# Altium schematic sheet ADC_PowerSupply.SchDoc
size A4; Organization: Altium Limited; Address1: L3, 12a Rodborough Rd; Address2: Frenchs Forest; Address3: NSW; Address4: Australia 2086
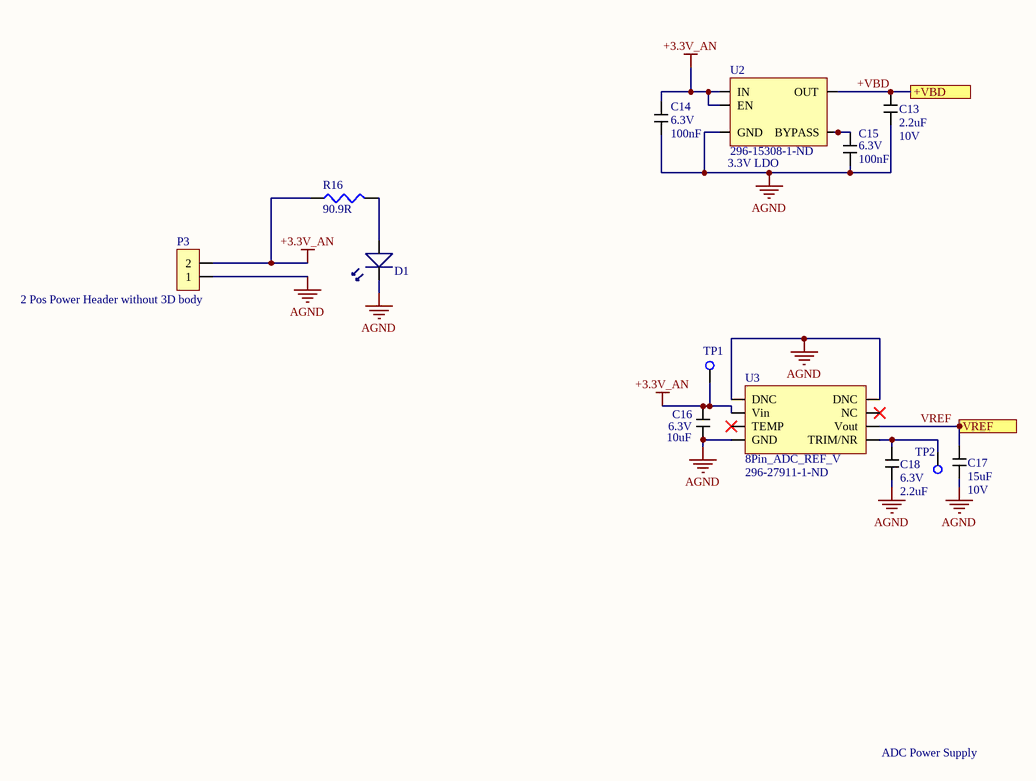
[diagram p0: ADC_PowerSupply.SchDoc]

## Parts
C13  Capacitance: 2.2uF  Voltage Rating: 10V  [2.2uF LDO Output Bypass Cap]  (hidden comment: 2.2uF LDO Bypass Cap)
C14  Voltage Rating: 6.3V  Capacitance: 100nF  [0.1uF Bypass Capacitor]  (hidden comment: 0.1uF)
C15  Voltage Rating: 6.3V  Capacitance: 100nF  [0.1uF Bypass Capacitor]  (hidden comment: 0.1uF)
C16  Voltage Rating: 6.3V  Capacitance: 10uF  [0805_MD_CAP]  (hidden comment: ADC_Volt_Ref_Input_Bypass_CAP10uF)
C17  Capacitance: 15uF  Voltage Rating: 10V  [1206_MD_CAP_Width_MOD]  (hidden comment: ADC_REF_VOLT_OUTPUT_CAP15UF)
C18  Voltage Rating: 6.3V  Capacitance: 2.2uF  [0603_MD_CAP]  (hidden comment: ADC_REF_VOLT_TRIM_CAP2.2UF)
D1  LED  [Green_SMD_LED]  (value not drawn)
P3  2 Pos Power Header without 3D body  [2 Pos Power Header - duplicate]
R16  Resistance: 90.9R  [Green_LED_Resistor_90.9]  (hidden comment: Green)
TP1  Test Point  [Test Point]  (value not drawn)
TP2  Test Point  [Test Point]  (value not drawn)
U2  Supplier Part Number 1: 296-15308-1-ND  [3.3V Dig ADC Supply]  (hidden comment: 3.3V Digital ADC Supply)
U3  8Pin_ADC_REF_V  Supplier Part Number 1: 296-27911-1-ND  [SOIC127P600X175-8N]

## Ports
+VBD, VREF

## Nets
+3.3V_AN: C14.2 C16.2 P3.2 R16.1 TP1.1 U2.1(IN) U2.3(EN) U3.2(Vin)
AGND: C13.1 C14.1 C15.1 C16.1 C17.1 C18.1 D1.1 P3.1 U2.2(GND) U3.1(DNC) U3.4(GND) U3.8(DNC)
+VBD: C13.2 U2.5(OUT) ; port +VBD
VREF: C17.2 U3.6(Vout) ; port VREF
NetC15_2: C15.2 U2.4(BYPASS)
NetC18_2: C18.2 TP2.1 U3.5(TRIM/NR)
NetD1_2: D1.2 R16.2

Not connected (* = marked no-connect by the designer): U3 3(TEMP)* 7(NC)*

## Notes on the sheet
- (near U2) 3.3V LDO
- ADC Power Supply
- Title
- Size:
- Date:
- A4
- Number:
- Time:
- Revision:
- Sheet
- of
- File:

## Library data of the parts
C13 = 2.2uF LDO Bypass Cap: 2.2µF ±10% 10V Ceramic Capacitor X7R 0805 (2012 Metric); Manufacturer: KEMET; Manufacturer Part Number: C0805C225K8RACAUTO; Supplier 1: Digi-Key; Stock 1: 53616; Pricing 1: 1=0.25000, 10=0.17200, 100=0.09770, 500=0.06898, 1000=0.06035 (USD); RoHS: Yes; Mount: Surface Mount; Case/Package: 0805; Case Code (Metric): 2012; Case Code (Imperial): 0805; Dielectric Material: Ceramic; Min Operating Temperature: -55°C; Max Operating Temperature: 125°C; Tolerance: 10%; Package Quantity: 1; Packaging: Cut Tape; Dielectric: X7R; Voltage Rating (DC): 10V; Length: 2mm; Height: 1.25mm; Width: 0.049inch; Thickness: 0.055inch; Depth: 1.25mm; Ratings: AEC-Q200; Radiation Hardening: No; REACH SVHC: No SVHC; ComponentLink1URL: http://www.farnell.com/datasheets/2741162.pdf?src-supplier=Farnell; ComponentLink1Description: http://www.farnell.com/datasheets/2741162.pdf?src-supplier=Farnell; ComponentLink2URL: http://components.arrow.com/part/dataview/0323_00327875?src-supplier=Arrow+Europe; ComponentLink2Description: http://components.arrow.com/part/dataview/0323_00327875?src-supplier=Arrow+Europe; ComponentLink3URL: http://components.arrow.com/part/dataview/43510464S9781270N7429?src-supplier=Arrow; ComponentLink3Description: http://components.arrow.com/part/dataview/43510464S9781270N7429?src-supplier=Arrow; ComponentLink4URL: http://www.farnell.com/datasheets/2741162.pdf?src-supplier=Newark; ComponentLink4Description: http://www.farnell.com/datasheets/2741162.pdf?src-supplier=Newark; ComponentLink5URL: http://www.farnell.com/datasheets/2120827.pdf?src-supplier=Element14; ComponentLink5Description: http://www.farnell.com/datasheets/2120827.pdf?src-supplier=Element14; ComponentLink6URL: http://capacitoredge.kemet.com/capedge2/DataSheet?pn=C0805C225K8RACAUTO&src-supplier=Avnet+Europe; ComponentLink6Description: http://capacitoredge.kemet.com/capedge2/DataSheet?pn=C0805C225K8RACAUTO&src-supplier=Avnet+Europe; ComponentLink7URL: https://search.kemet.com/component-edge/download/specsheet/C0805C225K8RACAUTO.pdf?src-supplier=Digi-Key; ComponentLink7Description: https://search.kemet.com/component-edge/download/specsheet/C0805C225K8RACAUTO.pdf?src-supplier=Digi-Key; ComponentLink8URL: https://api.kemet.com/component-edge/download/datasheet/C0805C225K8RACAUTO.pdf?src-supplier=Digi-Key; ComponentLink8Description: https://api.kemet.com/component-edge/download/datasheet/C0805C225K8RACAUTO.pdf?src-supplier=Digi-Key; Supplier Part Number 1: 399-6951-1-ND
C14 C15 = 0.1uF Cap: 0.1uF Bypass Cap; Manufacturer: KEMET; Manufacturer Part Number: C0603C104K9RACTU; Dielectric Material: Ceramic; Tolerance: 10%; Dielectric: X7R; Dissipation Factor: 5%; RoHS: Yes; Mount: Surface Mount; Case/Package: 0603; Case Code (Imperial): 0603; Case Code (Metric): 1608; Min Operating Temperature: -55°C; Max Operating Temperature: 125°C; Package Quantity: 4000; Packaging: Tape and Reel; Voltage Rating (DC): 6.3V; Termination: SMD/SMT; Length: 1.6mm; Height: 0.8mm; Width: 0.8mm; Thickness: 0.034inch; ComponentLink1URL: https://datasheet.ciiva.com/13371/kem-c1002-x7r-smd-357932-13371879.pdf?src-supplier=Mouser; ComponentLink1Description: https://datasheet.ciiva.com/13371/kem-c1002-x7r-smd-357932-13371879.pdf?src-supplier=Mouser; Supplier 1: Digi-Key; Stock 1: 758; Pricing 1: 1=0.19000, 10=0.13800, 100=0.06480, 500=0.04546, 1000=0.03763 (USD); Supplier Part Number 1: 399-15351-1-ND
C16 = ADC_Volt_Ref_Input_Bypass_CAP10uF: 10µF ±10% 6.3V Ceramic Capacitor X7R 0805 (2012 Metric); Manufacturer: Taiyo Yuden; Manufacturer Part Number: JMK212AB7106KGHT; Supplier 1: Digi-Key; RoHS: Yes; Stock 1: 179784; Pricing 1: 1 = 0.29000, 10 = 0.19900, 100 = 0.11250, 500 = 0.07940, 1000 = 0.06948 (USD); Mount: Surface Mount; Case/Package: 0805; Case Code (Metric): 2012; Case Code (Imperial): 0805; Min Operating Temperature: -55°C; Max Operating Temperature: 125°C; Package Quantity: 3000; Packaging: Tape and Reel; Tolerance: 10%; Voltage Rating (DC): 6.3V; Dielectric: X7R; Termination: SMD/SMT; Length: 0.079inch; Height: 1.25mm; Width: 0.049inch; Thickness: 0.053inch; Ratings: AEC-Q200; Lead Free: Lead Free; Halogen Free: Halogen Free; ComponentLink1URL: https://datasheet.ciiva.com/18697/mlcc01-hq-e-18697416.pdf?src-supplier=Digi-Key; ComponentLink1Description: https://datasheet.ciiva.com/18697/mlcc01-hq-e-18697416.pdf?src-supplier=Digi-Key; ComponentLink2URL: https://datasheet.ciiva.com/18697/mlcc01-hq-e-18697417.pdf?src-supplier=Digi-Key; ComponentLink2Description: https://datasheet.ciiva.com/18697/mlcc01-hq-e-18697417.pdf?src-supplier=Digi-Key; ComponentLink3URL: https://datasheet.ciiva.com/18697/mlcc01-hq-e-18697418.pdf?src-supplier=Digi-Key; ComponentLink3Description: https://datasheet.ciiva.com/18697/mlcc01-hq-e-18697418.pdf?src-supplier=Digi-Key; Supplier Part Number 1: 587-3388-1-ND
C17 = ADC_REF_VOLT_OUTPUT_CAP15UF: 15µF Molded Tantalum Capacitors 10V 1206 (3216 Metric) 1Ohm; Manufacturer: Kyocera AVX; Manufacturer Part Number: TPSA156K010R1000; Tolerance: 10%; ESR (Equivalent Series Resistance): 1R; Ripple Current: 110uA; Leakage Current: 1.5uA; Dissipation Factor: 6%; Polarity: Polar; Supplier 1: Digi-Key; RoHS: Yes; Stock 1: 4016; Pricing 1: 1 = 0.48000, 10 = 0.33300, 100 = 0.19980, 500 = 0.14986, 1000 = 0.12654 (USD); Mount: Surface Mount,PCB; Case/Package: 1206; Number of Pins: 2; Weight: 0.000571oz; Case Code (Metric): 3216; Case Code (Imperial): 1206; Dielectric Material: Tantalum; Min Operating Temperature: -55°C; Max Operating Temperature: 125°C; Packaging: Tape and Reel; Voltage Rating (DC): 10V; Package Quantity: 1; Termination: SMD/SMT; Voltage: 10V; Features: General Purpose; Length: 3.2mm; Height: 1.6mm; Width: 1.6mm; Height - Seated (Max): 0.071inch; Depth: 1.6mm; Radiation Hardening: No; REACH SVHC: No SVHC; Lead Free: Lead Free; ComponentLink1URL: https://datasheet.ciiva.com/11793/0900766b80962b61-11793618.pdf?src-supplier=RSComponents; ComponentLink1Description: https://datasheet.ciiva.com/11793/0900766b80962b61-11793618.pdf?src-supplier=RSComponents; ComponentLink2URL: https://datasheet.ciiva.com/19467/2019434-19467308.pdf?src-supplier=Jameco; ComponentLink2Description: https://datasheet.ciiva.com/19467/2019434-19467308.pdf?src-supplier=Jameco; ComponentLink3URL: https://datasheet.ciiva.com/263/tps-263720.pdf?src-supplier=Digi-Key; ComponentLink3Description: https://datasheet.ciiva.com/263/tps-263720.pdf?src-supplier=Digi-Key; ComponentLink4URL: https://datasheet.ciiva.com/263/tps-263721.pdf?src-supplier=Digi-Key; ComponentLink4Description: https://datasheet.ciiva.com/263/tps-263721.pdf?src-supplier=Digi-Key; ComponentLink5URL: https://datasheet.ciiva.com/7914/1680477-7914730.pdf?src-supplier=Element14; ComponentLink5Description: https://datasheet.ciiva.com/7914/1680477-7914730.pdf?src-supplier=Element14; ComponentLink6URL: https://datasheet.ciiva.com/263/tps-263722.pdf?src-supplier=Digi-Key; ComponentLink6Description: https://datasheet.ciiva.com/263/tps-263722.pdf?src-supplier=Digi-Key; ComponentLink7URL: https://datasheet.ciiva.com/3004/tps-3004586.pdf?src-supplier=Avnet; ComponentLink7Description: https://datasheet.ciiva.com/3004/tps-3004586.pdf?src-supplier=Avnet; ComponentLink8URL: https://datasheet.ciiva.com/12911/tps-23028-12911578.pdf?src-supplier=Mouser; ComponentLink8Description: https://datasheet.ciiva.com/12911/tps-23028-12911578.pdf?src-supplier=Mouser; ComponentLink9URL: https://datasheet.ciiva.com/14596/70001047-14596906.pdf?src-supplier=Allied+Electronics; ComponentLink9Description: https://datasheet.ciiva.com/14596/70001047-14596906.pdf?src-supplier=Allied+Electronics; ComponentLink10URL: https://datasheet.ciiva.com/7914/1680477-7914731.pdf?src-supplier=Element14; ComponentLink10Description: https://datasheet.ciiva.com/7914/1680477-7914731.pdf?src-supplier=Element14; ComponentLink11URL: https://datasheet.ciiva.com/7914/1680477-7914732.pdf?src-supplier=Element14; ComponentLink11Description: https://datasheet.ciiva.com/7914/1680477-7914732.pdf?src-supplier=Element14; Supplier Part Number 1: 478-1752-1-ND
C18 = ADC_REF_VOLT_TRIM_CAP2.2UF: 2.2µF ±10% 6.3V Ceramic Capacitor X7R 0603 (1608 Metric); Manufacturer: Taiyo Yuden; Manufacturer Part Number: JMK107B7225KAHTR; Supplier 1: Digi-Key; RoHS: No; Stock 1: 55560; Pricing 1: 1 = 0.24000, 10 = 0.16600, 100 = 0.09400, 500 = 0.06638, 1000 = 0.05808 (USD); Mount: Surface Mount; Case/Package: 0603; Case Code (Imperial): 0603; Case Code (Metric): 1608; Min Operating Temperature: -55°C; Max Operating Temperature: 125°C; Packaging: Cut Tape; Tolerance: 10%; Ratings: AEC-Q200; ComponentLink1URL: http://ds.yuden.co.jp/TYCOMPAS/ut/detail.do?productNo=JMK107B7225KAHTR&fileName=JMK107B7225KAHTR_SS&mode=specSheetDownload&src-supplier=Digi-Key; ComponentLink1Description: http://ds.yuden.co.jp/TYCOMPAS/ut/detail.do?productNo=JMK107B7225KAHTR&fileName=JMK107B7225KAHTR_SS&mode=specSheetDownload&src-supplier=Digi-Key; ComponentLink2URL: https://www.yuden.co.jp/productdata/catalog//mlcc11_hq_e.pdf?src-supplier=Digi-Key; ComponentLink2Description: https://www.yuden.co.jp/productdata/catalog//mlcc11_hq_e.pdf?src-supplier=Digi-Key; Supplier Part Number 1: 587-4899-1-ND
D1 = GREEN_LED: Manufacturer: Dialight; Manufacturer Part Number: 5988070107F; Color: Green; Lens Color: Colorless,Clear; Forward Voltage: 2V; Forward Current: 20mA; Wavelength: 570nm; Luminous Intensity: 20mcd; Viewing Angle: 140°; Lens Style: Flat,Rectangular,Diffused,Colorless,Clear; Dominant Wavelength: 568nm; Number of Elements: 1; Power Dissipation: 60mW; Reverse Voltage: 5V; Lens Transparency: Clear; Lens Size: 0.8mm; Supplier 1: Digi-Key; Stock 1: 228546; Pricing 1: 1=0.46, 10=0.33, 25=0.2528, 100=0.1648, 250=0.1209, 500=0.1026, 1000=0.0843 (USD); Mount: Surface Mount; Case/Package: 0603; Number of Pins: 2; Case Code (Metric): 1608; Case Code (Imperial): 0603; Min Operating Temperature: -30°C; Max Operating Temperature: 100°C; Package Quantity: 4000; Packaging: Tape and Reel; Illumination Color: Green; Test Current: 20mA; Number of LEDs: 1; Length: 1.6mm; Height: 0.7mm; Depth: 0.8mm; Width: 0.8mm; Radiation Hardening: No; Lead Free: Lead Free; REACH SVHC: No SVHC; ComponentLink1URL: http://www.mouser.com/ds/2/109/SMT_selector_guide-267443.pdf?src-supplier=Mouser; ComponentLink1Description: http://www.mouser.com/ds/2/109/SMT_selector_guide-267443.pdf?src-supplier=Mouser; ComponentLink2URL: http://uk.rs-online.com/webdocs/0ae2/0900766b80ae2975.pdf?src-supplier=RSComponents; ComponentLink2Description: http://uk.rs-online.com/webdocs/0ae2/0900766b80ae2975.pdf?src-supplier=RSComponents; ComponentLink3URL: http://www.farnell.com/datasheets/1720200.pdf?src-supplier=Element14; ComponentLink3Description: http://www.farnell.com/datasheets/1720200.pdf?src-supplier=Element14; ComponentLink4URL: https://media.digikey.com/pdf/Data%20Sheets/Dialight%20PDFs/598_Series_0603_Pkg.pdf?src-supplier=Digi-Key; ComponentLink4Description: https://media.digikey.com/pdf/Data%20Sheets/Dialight%20PDFs/598_Series_0603_Pkg.pdf?src-supplier=Digi-Key; ComponentLink5URL: http://www.farnell.com/datasheets/1484480.pdf?src-supplier=Element14; ComponentLink5Description: http://www.farnell.com/datasheets/1484480.pdf?src-supplier=Element14; ComponentLink6URL: https://www.alliedelec.com/m/d/745256ca487aea7b70ea31e2d673d5bb.pdf?src-supplier=Allied+Electronics; ComponentLink6Description: https://www.alliedelec.com/m/d/745256ca487aea7b70ea31e2d673d5bb.pdf?src-supplier=Allied+Electronics; ComponentLink7URL: http://www.onlinecomponents.com/productFiles/mf-DIA/mdei5980603.pdf?src-supplier=Onlinecomponents.com; ComponentLink7Description: http://www.onlinecomponents.com/productFiles/mf-DIA/mdei5980603.pdf?src-supplier=Onlinecomponents.com; ComponentLink8URL: https://www.verical.com/server-webapp/html/getDatasheet?partID=146438&src-supplier=Verical; ComponentLink8Description: https://www.verical.com/server-webapp/html/getDatasheet?partID=146438&src-supplier=Verical; ComponentLink9URL: http://www.dialight.com/Assets/Brochures_And_Catalogs/Indication/SMT_selector_guide.pdf?src-supplier=Future+Electronics; ComponentLink9Description: http://www.dialight.com/Assets/Brochures_And_Catalogs/Indication/SMT_selector_guide.pdf?src-supplier=Future+Electronics; Supplier Part Number 1: 350-2035-1-ND
P3 = 2 Pos Power Header without 3D body: No supplier part for this schematic symbol, only here to create board to board holes for the power header
R16 = Green_LED_Res: Manufacturer: Panasonic; Manufacturer Part Number: ERJ-1GNF90R9C; Power Rating: 50mW; Tolerance: 1%; Voltage Rating: 25V; Temperature Coefficient: 200ppm/°C; Voltage Rating (DC): 50V; Mount: Surface Mount; Case/Package: 0201; Case Code (Imperial): 0201; Case Code (Metric): 0603; Contact Plating: Tin,Matte; Min Operating Temperature: -55°C; Max Operating Temperature: 125°C; Package Quantity: 15000; Packaging: Tape and Reel; Composition: Thick Film; Number of Terminations: 2; Max Power Dissipation: 50mW; Termination: SMD/SMT; Length: 0.024inch; Height: 0.01inch; Width: 0.3mm; Radiation Hardening: No; Supplier 1: Digi-Key; Stock 1: 401780; Pricing 1: 1=0.10000, 10=0.02400, 100=0.00970, 1000=0.00437, 2500=0.00379 (USD); RoHS: Yes; Military Standard: Not; Depth: 0.8mm; Lead Free: Lead Free; ComponentLink1URL: https://datasheet.ciiva.com/15189/getdatasheetpartid-326528-15189836.pdf?src-supplier=Verical; ComponentLink1Description: https://datasheet.ciiva.com/15189/getdatasheetpartid-326528-15189836.pdf?src-supplier=Verical; ComponentLink2URL: https://datasheet.ciiva.com/12558/rc0603-272842-12558285.pdf?src-supplier=Mouser; ComponentLink2Description: https://datasheet.ciiva.com/12558/rc0603-272842-12558285.pdf?src-supplier=Mouser; Supplier Part Number 1: 311-90.9HRCT-ND
U2 = 3.3V Digital ADC Supply: Linear Voltage Regulator IC  1 Output  200mA SOT-23-5; Manufacturer: Texas Instruments; Manufacturer Part Number: TPS79333DBVRQ1; Number of Outputs: 1; Max Supply Voltage: 5.5V; Min Supply Voltage: 2.7V; Dropout Voltage: 102mV; Max Power Dissipation: 561mW; Input Bias Current: 170uA; Min Current Limit: 285mA; Polarity: Positive; Quiescent Current: 200uA; Output Voltage Accuracy: 2%; Output Type: Fixed; Supplier 1: Digi-Key; Stock 1: 3595; Pricing 1: 1=0.86000, 10=0.75600, 100=0.53820, 500=0.43510, 1000=0.33205 (USD); RoHS: Yes; Case/Package: SOT-23; Number of Pins: 5; Contact Plating: Gold; Min Operating Temperature: -40°C; Max Operating Temperature: 125°C; Package Quantity: 1; Output Current: 200mA; Output Voltage: 3.3V; Packaging: Tape and Reel; Nominal Output Voltage: 3.3V; Max Output Current: 200mA; Max Input Voltage: 5.5V; Min Input Voltage: 2.7V; Number of Regulators: 1; Power Dissipation: 561mW; Min Output Voltage: 3.3V; Max Output Voltage: 3.3V; Termination: SMD/SMT; Accuracy: 2%; Radiation Hardening: No; Lead Free: Lead Free; REACH SVHC: No SVHC; ComponentLink1URL: https://datasheet.ciiva.com/14277/tps79301-q1-14277552.pdf?src-supplier=Avnet; ComponentLink1Description: https://datasheet.ciiva.com/14277/tps79301-q1-14277552.pdf?src-supplier=Avnet; ComponentLink2URL: https://datasheet.ciiva.com/22700/1845238-22700085.pdf?src-supplier=Element14; ComponentLink2Description: https://datasheet.ciiva.com/22700/1845238-22700085.pdf?src-supplier=Element14; ComponentLink3URL: https://datasheet.ciiva.com/7993/1781686-7993219.pdf?src-supplier=Element14; ComponentLink3Description: https://datasheet.ciiva.com/7993/1781686-7993219.pdf?src-supplier=Element14; ComponentLink4URL: https://datasheet.ciiva.com/28684/1887604-28684539.pdf?src-supplier=Element14; ComponentLink4Description: https://datasheet.ciiva.com/28684/1887604-28684539.pdf?src-supplier=Element14
U3 = 8Pin_ADC_REF_V: Manufacturer: Texas Instruments; Manufacturer Part Number: REF5025AQDRQ1; Max Input Voltage: 18V; Output Voltage: 2.5V; Min Input Voltage: 2.7V; Nominal Supply Current: 800uA; Tolerance: 0.1%; Max Output Current: 10mA; Operating Supply Current: 1.2mA; Temperature Coefficient: 3ppm/°C; Reference Type: Series; Output Type: Fixed; Number of Channels: 1; Case/Package: D; Number of Pins: 8; Weight: 0.002677oz; Min Operating Temperature: -40°C; Max Operating Temperature: 125°C; Packaging: Tape and Reel; Package Quantity: 1; Min Output Voltage: 2.5V; Output Current: 10mA; Max Output Voltage: 2.5V; Quiescent Current: 800uA; Radiation Hardening: No; Lead Free: Lead Free; ComponentLink1URL: http://www.ti.com/lit/ds/symlink/ref5025a-q1.pdf; ComponentLink1Description: http://www.ti.com/lit/ds/symlink/ref5025a-q1.pdf; ComponentLink2URL: http://www.ti.com/lit/ds/symlink/ref5020a-q1.pdf?src-supplier=Digi-Key; ComponentLink2Description: http://www.ti.com/lit/ds/symlink/ref5020a-q1.pdf?src-supplier=Digi-Key; ComponentLink3URL: http://www.ti.com/lit/ds/symlink/ref5030a-q1.pdf?src-supplier=Digi-Key; ComponentLink3Description: http://www.ti.com/lit/ds/symlink/ref5030a-q1.pdf?src-supplier=Digi-Key; Supplier 1: Digi-Key; Stock 1: 16802; Pricing 1: 1=3.54, 10=3.182, 100=2.607, 500=2.2193, 1000=1.8717 (USD)